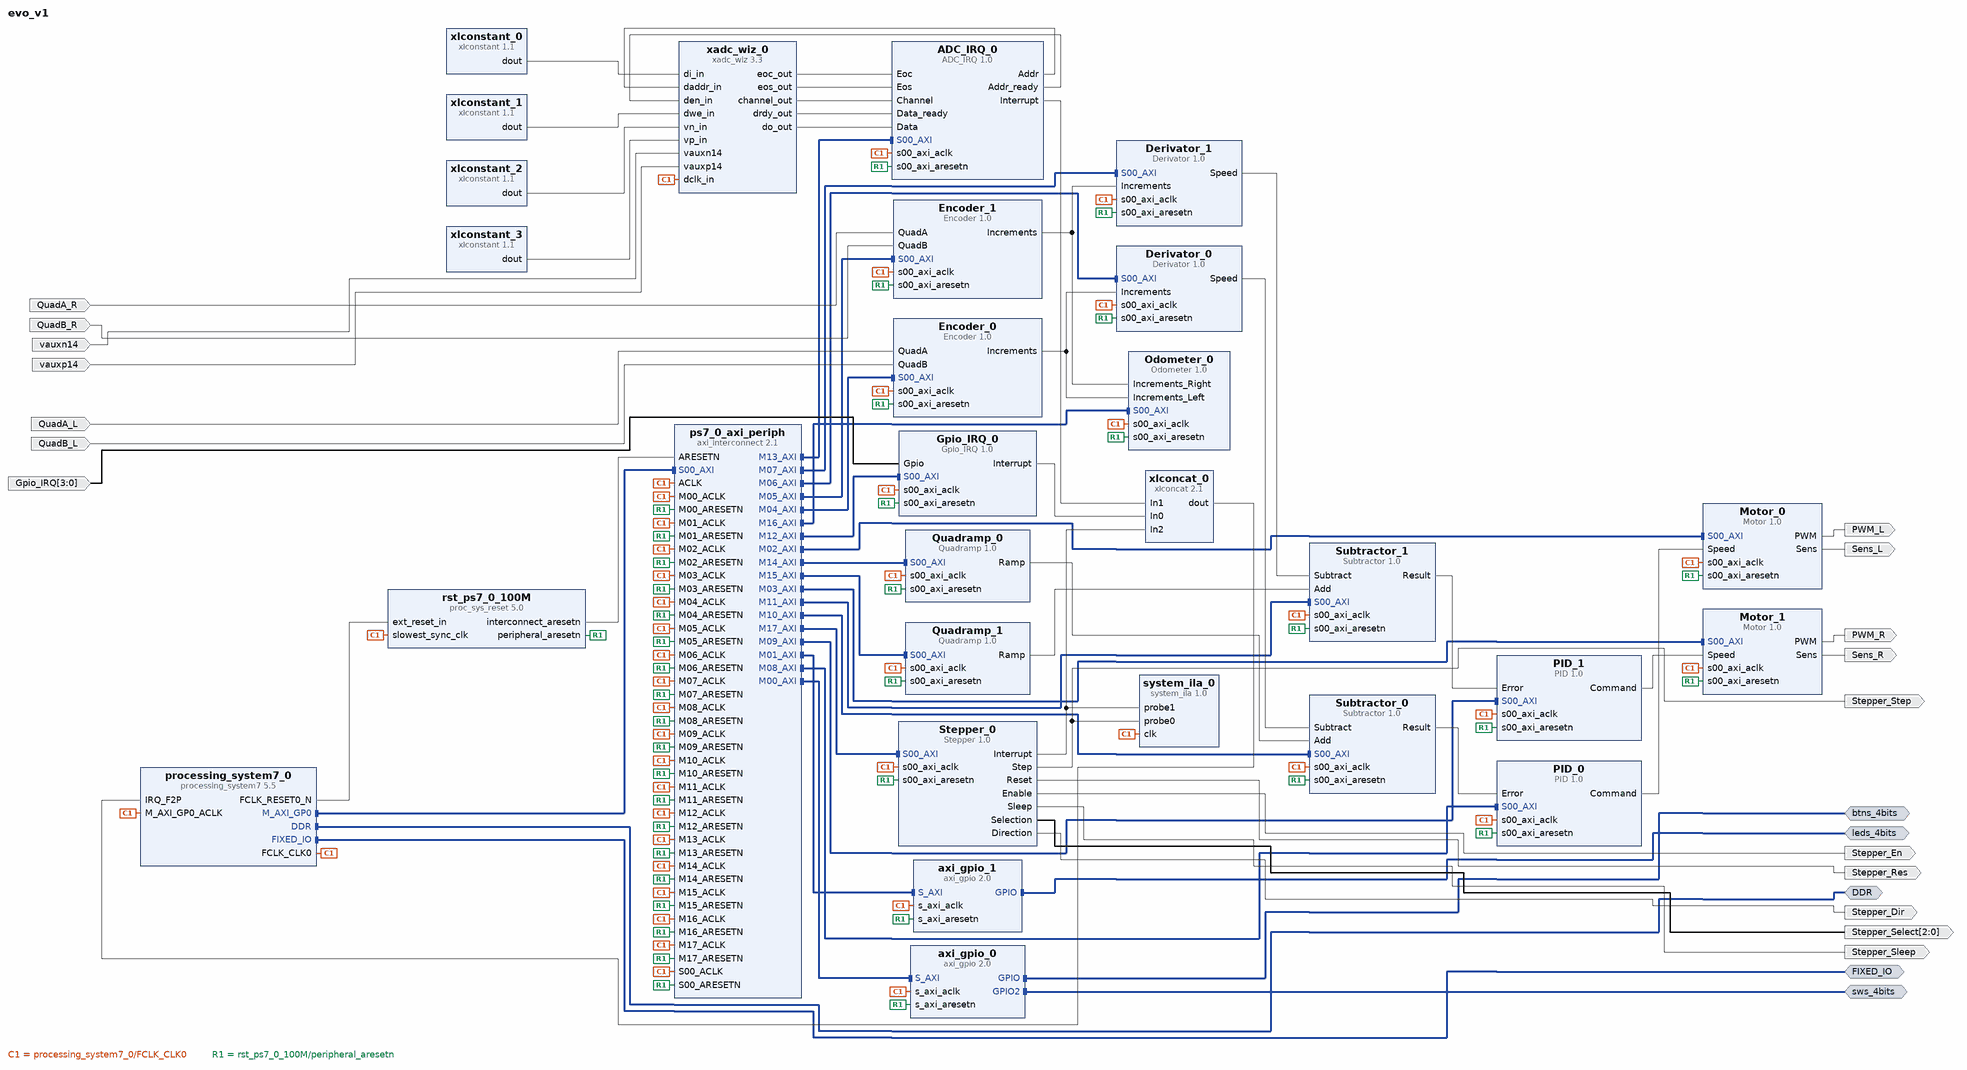
[diagram p0: block diagram of the top level]
# Vivado block design evo_v1, xc7z010clg400-1, Vivado 2017.2
create_bd_design evo_v1

create_bd_intf_port -mode Master -vlnv xilinx.com:interface:ddrx_rtl:1.0 DDR
create_bd_intf_port -mode Master -vlnv xilinx.com:display_processing_system7:fixedio_rtl:1.0 FIXED_IO
create_bd_intf_port -mode Master -vlnv xilinx.com:interface:gpio_rtl:1.0 leds_4bits
create_bd_intf_port -mode Master -vlnv xilinx.com:interface:gpio_rtl:1.0 btns_4bits
create_bd_intf_port -mode Master -vlnv xilinx.com:interface:gpio_rtl:1.0 sws_4bits
create_bd_port -dir I QuadA_L
create_bd_port -dir I QuadB_L
create_bd_port -dir I QuadA_R
create_bd_port -dir I QuadB_R
create_bd_port -dir O Sens_L
create_bd_port -dir O PWM_L
create_bd_port -dir O Sens_R
create_bd_port -dir O PWM_R
create_bd_port -dir I vauxn14
create_bd_port -dir I vauxp14
create_bd_port -dir I -from 3 -to 0 Gpio_IRQ
create_bd_port -dir O -type rst Stepper_Res
create_bd_port -dir O Stepper_En
create_bd_port -dir O Stepper_Sleep
create_bd_port -dir O -from 2 -to 0 Stepper_Select
create_bd_port -dir O Stepper_Step
create_bd_port -dir O Stepper_Dir

create_bd_cell -type ip -vlnv xilinx.com:ip:processing_system7:5.5 processing_system7_0
set_property -dict [list \
  CONFIG.PCW_UIPARAM_DDR_FREQ_MHZ 525 \
  CONFIG.PCW_CRYSTAL_PERIPHERAL_FREQMHZ 50.000000 \
  CONFIG.PCW_APU_PERIPHERAL_FREQMHZ 650 \
  CONFIG.PCW_SDIO_PERIPHERAL_FREQMHZ 50 \
  CONFIG.PCW_FPGA0_PERIPHERAL_FREQMHZ 100 \
  CONFIG.PCW_USE_FABRIC_INTERRUPT 1 \
  CONFIG.PCW_IRQ_F2P_INTR 1 \
  CONFIG.PCW_PRESET_BANK1_VOLTAGE {LVCMOS 1.8V} \
  CONFIG.PCW_UIPARAM_DDR_PARTNO {MT41K128M16 JT-125} \
  CONFIG.PCW_QSPI_PERIPHERAL_ENABLE 1 \
  CONFIG.PCW_QSPI_GRP_SINGLE_SS_ENABLE 1 \
  CONFIG.PCW_QSPI_GRP_FBCLK_ENABLE 1 \
  CONFIG.PCW_ENET0_PERIPHERAL_ENABLE 1 \
  CONFIG.PCW_ENET0_ENET0_IO {MIO 16 .. 27} \
  CONFIG.PCW_ENET0_GRP_MDIO_ENABLE 1 \
  CONFIG.PCW_ENET0_RESET_ENABLE 0 \
  CONFIG.PCW_SD0_PERIPHERAL_ENABLE 1 \
  CONFIG.PCW_SD0_GRP_CD_ENABLE 1 \
  CONFIG.PCW_SD0_GRP_CD_IO {MIO 47} \
  CONFIG.PCW_SD0_GRP_WP_ENABLE 1 \
  CONFIG.PCW_UART1_PERIPHERAL_ENABLE 1 \
  CONFIG.PCW_TTC0_PERIPHERAL_ENABLE 1 \
  CONFIG.PCW_USB0_PERIPHERAL_ENABLE 1 \
  CONFIG.PCW_USB0_RESET_ENABLE 1 \
  CONFIG.PCW_USB0_RESET_IO {MIO 46} \
  CONFIG.PCW_GPIO_MIO_GPIO_ENABLE 1 \
] [get_bd_cells processing_system7_0]
# 105 more settings of processing_system7_0 are not shown: defaults, MIO pin electricals, DDR timing, and values the tool derives
create_bd_cell -type ip -vlnv xilinx.com:ip:axi_gpio:2.0 axi_gpio_0
set_property -dict [list \
  CONFIG.C_INTERRUPT_PRESENT 0 \
  CONFIG.USE_BOARD_FLOW true \
  CONFIG.GPIO_BOARD_INTERFACE btns_4bits \
  CONFIG.GPIO2_BOARD_INTERFACE sws_4bits \
] [get_bd_cells axi_gpio_0]
create_bd_cell -type ip -vlnv xilinx.com:ip:axi_gpio:2.0 axi_gpio_1
set_property -dict {CONFIG.USE_BOARD_FLOW true CONFIG.GPIO_BOARD_INTERFACE leds_4bits} [get_bd_cells axi_gpio_1]
create_bd_cell -type ip -vlnv xilinx.com:ip:axi_interconnect:2.1 ps7_0_axi_periph
set_property -dict {CONFIG.NUM_MI 18} [get_bd_cells ps7_0_axi_periph]
create_bd_cell -type ip -vlnv xilinx.com:ip:proc_sys_reset:5.0 rst_ps7_0_100M
create_bd_cell -type ip -vlnv xilinx.com:user:Encoder:1.0 Encoder_0
create_bd_cell -type ip -vlnv xilinx.com:user:Encoder:1.0 Encoder_1
create_bd_cell -type ip -vlnv xilinx.com:user:Subtractor:1.0 Subtractor_0
create_bd_cell -type ip -vlnv xilinx.com:user:Subtractor:1.0 Subtractor_1
create_bd_cell -type ip -vlnv xilinx.com:user:PID:1.0 PID_0
set_property -dict {CONFIG.MIN 1 CONFIG.MAX 1} [get_bd_cells PID_0]
create_bd_cell -type ip -vlnv xilinx.com:user:PID:1.0 PID_1
set_property -dict {CONFIG.MIN 1 CONFIG.MAX 1} [get_bd_cells PID_1]
create_bd_cell -type ip -vlnv xilinx.com:user:Motor:1.0 Motor_0
create_bd_cell -type ip -vlnv xilinx.com:user:Motor:1.0 Motor_1
create_bd_cell -type ip -vlnv xilinx.com:ip:xadc_wiz:3.3 xadc_wiz_0
set_property -dict [list \
  CONFIG.INTERFACE_SELECTION ENABLE_DRP \
  CONFIG.XADC_STARUP_SELECTION channel_sequencer \
  CONFIG.SEQUENCER_MODE Continuous \
  CONFIG.ENABLE_RESET false \
  CONFIG.OT_ALARM false \
  CONFIG.USER_TEMP_ALARM false \
  CONFIG.VCCINT_ALARM false \
  CONFIG.VCCAUX_ALARM false \
  CONFIG.ENABLE_VCCPINT_ALARM false \
  CONFIG.ENABLE_VCCPAUX_ALARM false \
  CONFIG.ENABLE_VCCDDRO_ALARM false \
  CONFIG.SINGLE_CHANNEL_SELECTION TEMPERATURE \
  CONFIG.CHANNEL_AVERAGING None \
  CONFIG.ADC_OFFSET_CALIBRATION false \
  CONFIG.EXTERNAL_MUX_CHANNEL VP_VN \
  CONFIG.CHANNEL_ENABLE_CALIBRATION false \
  CONFIG.CHANNEL_ENABLE_TEMPERATURE false \
  CONFIG.CHANNEL_ENABLE_VCCINT false \
  CONFIG.CHANNEL_ENABLE_VCCAUX false \
  CONFIG.CHANNEL_ENABLE_VP_VN true \
  CONFIG.CHANNEL_ENABLE_VBRAM false \
  CONFIG.CHANNEL_ENABLE_VCCPINT false \
  CONFIG.CHANNEL_ENABLE_VCCPAUX false \
  CONFIG.CHANNEL_ENABLE_VCCDDRO false \
  CONFIG.CHANNEL_ENABLE_VAUXP4_VAUXN4 false \
  CONFIG.CHANNEL_ENABLE_VAUXP14_VAUXN14 true \
  CONFIG.AVERAGE_ENABLE_VAUXP14_VAUXN14 false \
] [get_bd_cells xadc_wiz_0]
create_bd_cell -type ip -vlnv xilinx.com:ip:xlconstant:1.1 xlconstant_0
set_property -dict {CONFIG.CONST_WIDTH 16 CONFIG.CONST_VAL 0} [get_bd_cells xlconstant_0]
create_bd_cell -type ip -vlnv xilinx.com:ip:xlconstant:1.1 xlconstant_1
set_property -dict {CONFIG.CONST_VAL 0} [get_bd_cells xlconstant_1]
create_bd_cell -type ip -vlnv xilinx.com:ip:xlconcat:2.1 xlconcat_0
set_property -dict {CONFIG.NUM_PORTS 3} [get_bd_cells xlconcat_0]
create_bd_cell -type ip -vlnv xilinx.com:ip:xlconstant:1.1 xlconstant_2
set_property -dict {CONFIG.CONST_WIDTH 1 CONFIG.CONST_VAL 0} [get_bd_cells xlconstant_2]
create_bd_cell -type ip -vlnv xilinx.com:ip:xlconstant:1.1 xlconstant_3
set_property -dict {CONFIG.CONST_WIDTH 1 CONFIG.CONST_VAL 0} [get_bd_cells xlconstant_3]
create_bd_cell -type ip -vlnv xilinx.com:user:ADC_IRQ:1.0 ADC_IRQ_0
create_bd_cell -type ip -vlnv xilinx.com:user:Gpio_IRQ:1.0 Gpio_IRQ_0
set_property -dict {CONFIG.GPIO_DATA_WIDTH 4} [get_bd_cells Gpio_IRQ_0]
create_bd_cell -type ip -vlnv xilinx.com:user:Odometer:1.0 Odometer_0
create_bd_cell -type ip -vlnv xilinx.com:user:Derivator:1.0 Derivator_0
create_bd_cell -type ip -vlnv xilinx.com:user:Derivator:1.0 Derivator_1
create_bd_cell -type ip -vlnv xilinx.com:user:Quadramp:1.0 Quadramp_0
create_bd_cell -type ip -vlnv xilinx.com:user:Quadramp:1.0 Quadramp_1
create_bd_cell -type ip -vlnv xilinx.com:ip:system_ila:1.0 system_ila_0
set_property -dict [list \
  CONFIG.C_SLOT_0_APC_EN 0 \
  CONFIG.C_SLOT_0_AXI_AW_SEL_DATA 1 \
  CONFIG.C_SLOT_0_AXI_W_SEL_DATA 1 \
  CONFIG.C_SLOT_0_AXI_B_SEL_DATA 1 \
  CONFIG.C_SLOT_0_AXI_AR_SEL_DATA 1 \
  CONFIG.C_SLOT_0_AXI_R_SEL_DATA 1 \
  CONFIG.C_SLOT_0_AXI_AW_SEL_TRIG 1 \
  CONFIG.C_SLOT_0_AXI_W_SEL_TRIG 1 \
  CONFIG.C_SLOT_0_AXI_B_SEL_TRIG 1 \
  CONFIG.C_SLOT_0_AXI_AR_SEL_TRIG 1 \
  CONFIG.C_SLOT_0_AXI_R_SEL_TRIG 1 \
  CONFIG.C_PROBE8_TYPE 0 \
  CONFIG.C_PROBE7_TYPE 0 \
  CONFIG.C_PROBE6_TYPE 0 \
  CONFIG.C_PROBE5_TYPE 0 \
  CONFIG.C_PROBE4_TYPE 0 \
  CONFIG.C_PROBE3_TYPE 0 \
  CONFIG.C_PROBE2_TYPE 0 \
  CONFIG.C_PROBE1_TYPE 0 \
  CONFIG.C_PROBE0_TYPE 0 \
  CONFIG.C_DATA_DEPTH 4096 \
  CONFIG.C_NUM_OF_PROBES 2 \
  CONFIG.C_NUM_MONITOR_SLOTS 1 \
  CONFIG.C_SLOT_0_INTF_TYPE xilinx.com:interface:aximm_rtl:1.0 \
  CONFIG.C_MON_TYPE NATIVE \
] [get_bd_cells system_ila_0]
create_bd_cell -type ip -vlnv xilinx.com:user:Stepper:1.0 Stepper_0

# ---- connections ----

connect_bd_intf_net [get_bd_intf_pins processing_system7_0/M_AXI_GP0] [get_bd_intf_pins ps7_0_axi_periph/S00_AXI]
connect_bd_intf_net [get_bd_intf_pins ps7_0_axi_periph/M00_AXI] [get_bd_intf_pins axi_gpio_0/S_AXI]
connect_bd_intf_net [get_bd_intf_pins ps7_0_axi_periph/M01_AXI] [get_bd_intf_pins axi_gpio_1/S_AXI]
connect_bd_intf_net [get_bd_intf_pins ps7_0_axi_periph/M02_AXI] [get_bd_intf_pins Motor_0/S00_AXI]
connect_bd_intf_net [get_bd_intf_pins ps7_0_axi_periph/M03_AXI] [get_bd_intf_pins Motor_1/S00_AXI]
connect_bd_intf_net [get_bd_intf_pins ps7_0_axi_periph/M04_AXI] [get_bd_intf_pins Encoder_0/S00_AXI]
connect_bd_intf_net [get_bd_intf_pins ps7_0_axi_periph/M05_AXI] [get_bd_intf_pins Encoder_1/S00_AXI]
connect_bd_intf_net [get_bd_intf_pins ps7_0_axi_periph/M06_AXI] [get_bd_intf_pins Derivator_0/S00_AXI]
connect_bd_intf_net [get_bd_intf_pins ps7_0_axi_periph/M07_AXI] [get_bd_intf_pins Derivator_1/S00_AXI]
connect_bd_intf_net [get_bd_intf_pins ps7_0_axi_periph/M08_AXI] [get_bd_intf_pins PID_0/S00_AXI]
connect_bd_intf_net [get_bd_intf_pins ps7_0_axi_periph/M09_AXI] [get_bd_intf_pins PID_1/S00_AXI]
connect_bd_intf_net [get_bd_intf_pins ps7_0_axi_periph/M10_AXI] [get_bd_intf_pins Subtractor_0/S00_AXI]
connect_bd_intf_net [get_bd_intf_pins ps7_0_axi_periph/M11_AXI] [get_bd_intf_pins Subtractor_1/S00_AXI]
connect_bd_intf_net [get_bd_intf_pins ps7_0_axi_periph/M12_AXI] [get_bd_intf_pins Gpio_IRQ_0/S00_AXI]
connect_bd_intf_net [get_bd_intf_pins ADC_IRQ_0/S00_AXI] [get_bd_intf_pins ps7_0_axi_periph/M13_AXI]
connect_bd_intf_net [get_bd_intf_pins ps7_0_axi_periph/M14_AXI] [get_bd_intf_pins Quadramp_0/S00_AXI]
connect_bd_intf_net [get_bd_intf_pins ps7_0_axi_periph/M15_AXI] [get_bd_intf_pins Quadramp_1/S00_AXI]
connect_bd_intf_net [get_bd_intf_pins ps7_0_axi_periph/M16_AXI] [get_bd_intf_pins Odometer_0/S00_AXI]
connect_bd_intf_net [get_bd_intf_pins ps7_0_axi_periph/M17_AXI] [get_bd_intf_pins Stepper_0/S00_AXI]
connect_bd_intf_net [get_bd_intf_ports DDR] [get_bd_intf_pins processing_system7_0/DDR]
connect_bd_intf_net [get_bd_intf_ports FIXED_IO] [get_bd_intf_pins processing_system7_0/FIXED_IO]
connect_bd_intf_net [get_bd_intf_ports leds_4bits] [get_bd_intf_pins axi_gpio_1/GPIO]
connect_bd_intf_net [get_bd_intf_ports btns_4bits] [get_bd_intf_pins axi_gpio_0/GPIO]
connect_bd_intf_net [get_bd_intf_ports sws_4bits] [get_bd_intf_pins axi_gpio_0/GPIO2]
connect_bd_net [get_bd_pins processing_system7_0/FCLK_CLK0] \
  [get_bd_pins processing_system7_0/M_AXI_GP0_ACLK] [get_bd_pins rst_ps7_0_100M/slowest_sync_clk] \
  [get_bd_pins axi_gpio_0/s_axi_aclk] [get_bd_pins axi_gpio_1/s_axi_aclk] [get_bd_pins Encoder_0/s00_axi_aclk] \
  [get_bd_pins Encoder_1/s00_axi_aclk] [get_bd_pins Subtractor_0/s00_axi_aclk] [get_bd_pins Subtractor_1/s00_axi_aclk] \
  [get_bd_pins PID_0/s00_axi_aclk] [get_bd_pins PID_1/s00_axi_aclk] [get_bd_pins Motor_0/s00_axi_aclk] \
  [get_bd_pins Motor_1/s00_axi_aclk] [get_bd_pins xadc_wiz_0/dclk_in] [get_bd_pins ADC_IRQ_0/s00_axi_aclk] \
  [get_bd_pins Gpio_IRQ_0/s00_axi_aclk] [get_bd_pins Odometer_0/s00_axi_aclk] [get_bd_pins Derivator_0/s00_axi_aclk] \
  [get_bd_pins Derivator_1/s00_axi_aclk] [get_bd_pins Quadramp_0/s00_axi_aclk] [get_bd_pins Quadramp_1/s00_axi_aclk] \
  [get_bd_pins system_ila_0/clk] [get_bd_pins ps7_0_axi_periph/S00_ACLK] [get_bd_pins ps7_0_axi_periph/M00_ACLK] \
  [get_bd_pins ps7_0_axi_periph/ACLK] [get_bd_pins ps7_0_axi_periph/M01_ACLK] [get_bd_pins ps7_0_axi_periph/M02_ACLK] \
  [get_bd_pins ps7_0_axi_periph/M03_ACLK] [get_bd_pins ps7_0_axi_periph/M04_ACLK] [get_bd_pins ps7_0_axi_periph/M05_ACLK] \
  [get_bd_pins ps7_0_axi_periph/M06_ACLK] [get_bd_pins ps7_0_axi_periph/M07_ACLK] [get_bd_pins ps7_0_axi_periph/M08_ACLK] \
  [get_bd_pins ps7_0_axi_periph/M09_ACLK] [get_bd_pins ps7_0_axi_periph/M10_ACLK] [get_bd_pins ps7_0_axi_periph/M11_ACLK] \
  [get_bd_pins ps7_0_axi_periph/M12_ACLK] [get_bd_pins ps7_0_axi_periph/M13_ACLK] [get_bd_pins ps7_0_axi_periph/M14_ACLK] \
  [get_bd_pins ps7_0_axi_periph/M15_ACLK] [get_bd_pins ps7_0_axi_periph/M16_ACLK] [get_bd_pins ps7_0_axi_periph/M17_ACLK] \
  [get_bd_pins Stepper_0/s00_axi_aclk]
connect_bd_net [get_bd_pins rst_ps7_0_100M/peripheral_aresetn] \
  [get_bd_pins axi_gpio_0/s_axi_aresetn] [get_bd_pins axi_gpio_1/s_axi_aresetn] [get_bd_pins Encoder_0/s00_axi_aresetn] \
  [get_bd_pins Encoder_1/s00_axi_aresetn] [get_bd_pins Subtractor_0/s00_axi_aresetn] \
  [get_bd_pins Subtractor_1/s00_axi_aresetn] [get_bd_pins PID_0/s00_axi_aresetn] [get_bd_pins PID_1/s00_axi_aresetn] \
  [get_bd_pins Motor_0/s00_axi_aresetn] [get_bd_pins Motor_1/s00_axi_aresetn] [get_bd_pins ADC_IRQ_0/s00_axi_aresetn] \
  [get_bd_pins Gpio_IRQ_0/s00_axi_aresetn] [get_bd_pins Odometer_0/s00_axi_aresetn] [get_bd_pins Derivator_0/s00_axi_aresetn] \
  [get_bd_pins Derivator_1/s00_axi_aresetn] [get_bd_pins Quadramp_0/s00_axi_aresetn] [get_bd_pins Quadramp_1/s00_axi_aresetn] \
  [get_bd_pins ps7_0_axi_periph/S00_ARESETN] [get_bd_pins ps7_0_axi_periph/M00_ARESETN] \
  [get_bd_pins ps7_0_axi_periph/M01_ARESETN] [get_bd_pins ps7_0_axi_periph/M02_ARESETN] \
  [get_bd_pins ps7_0_axi_periph/M03_ARESETN] [get_bd_pins ps7_0_axi_periph/M04_ARESETN] \
  [get_bd_pins ps7_0_axi_periph/M05_ARESETN] [get_bd_pins ps7_0_axi_periph/M06_ARESETN] \
  [get_bd_pins ps7_0_axi_periph/M07_ARESETN] [get_bd_pins ps7_0_axi_periph/M08_ARESETN] \
  [get_bd_pins ps7_0_axi_periph/M09_ARESETN] [get_bd_pins ps7_0_axi_periph/M10_ARESETN] \
  [get_bd_pins ps7_0_axi_periph/M11_ARESETN] [get_bd_pins ps7_0_axi_periph/M12_ARESETN] \
  [get_bd_pins ps7_0_axi_periph/M13_ARESETN] [get_bd_pins ps7_0_axi_periph/M14_ARESETN] \
  [get_bd_pins ps7_0_axi_periph/M15_ARESETN] [get_bd_pins ps7_0_axi_periph/M16_ARESETN] \
  [get_bd_pins ps7_0_axi_periph/M17_ARESETN] [get_bd_pins Stepper_0/s00_axi_aresetn]
connect_bd_net [get_bd_pins rst_ps7_0_100M/interconnect_aresetn] [get_bd_pins ps7_0_axi_periph/ARESETN]
connect_bd_net [get_bd_pins PID_1/Command] [get_bd_pins Motor_1/Speed]
connect_bd_net [get_bd_pins Subtractor_1/Result] [get_bd_pins PID_1/Error]
connect_bd_net [get_bd_pins Derivator_1/Speed] [get_bd_pins Subtractor_1/Subtract]
connect_bd_net [get_bd_pins Encoder_1/Increments] [get_bd_pins Odometer_0/Increments_Right] [get_bd_pins Derivator_1/Increments]
connect_bd_net [get_bd_pins Encoder_0/Increments] [get_bd_pins Odometer_0/Increments_Left] [get_bd_pins Derivator_0/Increments]
connect_bd_net [get_bd_pins Derivator_0/Speed] [get_bd_pins Subtractor_0/Subtract]
connect_bd_net [get_bd_pins Subtractor_0/Result] [get_bd_pins PID_0/Error]
connect_bd_net [get_bd_pins PID_0/Command] [get_bd_pins Motor_0/Speed]
connect_bd_net [get_bd_pins processing_system7_0/FCLK_RESET0_N] [get_bd_pins rst_ps7_0_100M/ext_reset_in]
connect_bd_net [get_bd_ports QuadA_L] [get_bd_pins Encoder_0/QuadA]
connect_bd_net [get_bd_ports QuadB_L] [get_bd_pins Encoder_0/QuadB]
connect_bd_net [get_bd_ports QuadA_R] [get_bd_pins Encoder_1/QuadA]
connect_bd_net [get_bd_ports QuadB_R] [get_bd_pins Encoder_1/QuadB]
connect_bd_net [get_bd_pins Motor_0/Sens] [get_bd_ports Sens_L]
connect_bd_net [get_bd_pins Motor_0/PWM] [get_bd_ports PWM_L]
connect_bd_net [get_bd_pins Motor_1/Sens] [get_bd_ports Sens_R]
connect_bd_net [get_bd_pins Motor_1/PWM] [get_bd_ports PWM_R]
connect_bd_net [get_bd_pins xlconstant_0/dout] [get_bd_pins xadc_wiz_0/di_in]
connect_bd_net [get_bd_pins xlconstant_1/dout] [get_bd_pins xadc_wiz_0/dwe_in]
connect_bd_net -net vauxn14_1 [get_bd_ports vauxn14] [get_bd_pins xadc_wiz_0/vauxn14]
connect_bd_net -net vauxp14_1 [get_bd_ports vauxp14] [get_bd_pins xadc_wiz_0/vauxp14]
connect_bd_net [get_bd_pins ADC_IRQ_0/Addr] [get_bd_pins xadc_wiz_0/daddr_in]
connect_bd_net [get_bd_pins ADC_IRQ_0/Addr_ready] [get_bd_pins xadc_wiz_0/den_in]
connect_bd_net [get_bd_pins xadc_wiz_0/eoc_out] [get_bd_pins ADC_IRQ_0/Eoc]
connect_bd_net [get_bd_pins xadc_wiz_0/eos_out] [get_bd_pins ADC_IRQ_0/Eos]
connect_bd_net [get_bd_pins xadc_wiz_0/channel_out] [get_bd_pins ADC_IRQ_0/Channel]
connect_bd_net [get_bd_pins xadc_wiz_0/drdy_out] [get_bd_pins ADC_IRQ_0/Data_ready]
connect_bd_net [get_bd_pins xadc_wiz_0/do_out] [get_bd_pins ADC_IRQ_0/Data]
connect_bd_net [get_bd_pins ADC_IRQ_0/Interrupt] [get_bd_pins xlconcat_0/In1]
connect_bd_net [get_bd_pins Gpio_IRQ_0/Interrupt] [get_bd_pins xlconcat_0/In0]
connect_bd_net [get_bd_pins xlconcat_0/dout] [get_bd_pins processing_system7_0/IRQ_F2P]
connect_bd_net [get_bd_pins Quadramp_0/Ramp] [get_bd_pins Subtractor_0/Add]
connect_bd_net [get_bd_pins Quadramp_1/Ramp] [get_bd_pins Subtractor_1/Add]
connect_bd_net [get_bd_pins xlconstant_2/dout] [get_bd_pins xadc_wiz_0/vn_in]
connect_bd_net [get_bd_pins xlconstant_3/dout] [get_bd_pins xadc_wiz_0/vp_in]
connect_bd_net [get_bd_ports Gpio_IRQ] [get_bd_pins Gpio_IRQ_0/Gpio]
connect_bd_net [get_bd_pins Stepper_0/Reset] [get_bd_ports Stepper_Res]
connect_bd_net [get_bd_pins Stepper_0/Enable] [get_bd_ports Stepper_En]
connect_bd_net [get_bd_pins Stepper_0/Sleep] [get_bd_ports Stepper_Sleep]
connect_bd_net [get_bd_pins Stepper_0/Selection] [get_bd_ports Stepper_Select]
connect_bd_net [get_bd_pins Stepper_0/Step] [get_bd_ports Stepper_Step] [get_bd_pins system_ila_0/probe0]
connect_bd_net [get_bd_pins Stepper_0/Direction] [get_bd_ports Stepper_Dir]
connect_bd_net [get_bd_pins Stepper_0/Interrupt] [get_bd_pins xlconcat_0/In2] [get_bd_pins system_ila_0/probe1]

# ---- address map ----
assign_bd_address -offset 0x41200000 -range 64K -target_address_space [get_bd_addr_spaces processing_system7_0/Data] [get_bd_addr_segs axi_gpio_0/S_AXI/Reg]
assign_bd_address -offset 0x41210000 -range 64K -target_address_space [get_bd_addr_spaces processing_system7_0/Data] [get_bd_addr_segs axi_gpio_1/S_AXI/Reg]
assign_bd_address -offset 0x43C00000 -range 64K -target_address_space [get_bd_addr_spaces processing_system7_0/Data] [get_bd_addr_segs Motor_0/S00_AXI/S00_AXI_reg]
assign_bd_address -offset 0x43C10000 -range 64K -target_address_space [get_bd_addr_spaces processing_system7_0/Data] [get_bd_addr_segs Motor_1/S00_AXI/S00_AXI_reg]
assign_bd_address -offset 0x43C20000 -range 64K -target_address_space [get_bd_addr_spaces processing_system7_0/Data] [get_bd_addr_segs Encoder_0/S00_AXI/S00_AXI_reg]
assign_bd_address -offset 0x43C30000 -range 64K -target_address_space [get_bd_addr_spaces processing_system7_0/Data] [get_bd_addr_segs Encoder_1/S00_AXI/S00_AXI_reg]
assign_bd_address -offset 0x43C40000 -range 64K -target_address_space [get_bd_addr_spaces processing_system7_0/Data] [get_bd_addr_segs Derivator_0/S00_AXI/S00_AXI_reg]
assign_bd_address -offset 0x43C50000 -range 64K -target_address_space [get_bd_addr_spaces processing_system7_0/Data] [get_bd_addr_segs Derivator_1/S00_AXI/S00_AXI_reg]
assign_bd_address -offset 0x43C60000 -range 64K -target_address_space [get_bd_addr_spaces processing_system7_0/Data] [get_bd_addr_segs PID_0/S00_AXI/S00_AXI_reg]
assign_bd_address -offset 0x43C70000 -range 64K -target_address_space [get_bd_addr_spaces processing_system7_0/Data] [get_bd_addr_segs PID_1/S00_AXI/S00_AXI_reg]
assign_bd_address -offset 0x43C80000 -range 64K -target_address_space [get_bd_addr_spaces processing_system7_0/Data] [get_bd_addr_segs Subtractor_0/S00_AXI/S00_AXI_reg]
assign_bd_address -offset 0x43C90000 -range 64K -target_address_space [get_bd_addr_spaces processing_system7_0/Data] [get_bd_addr_segs Subtractor_1/S00_AXI/S00_AXI_reg]
assign_bd_address -offset 0x43CA0000 -range 64K -target_address_space [get_bd_addr_spaces processing_system7_0/Data] [get_bd_addr_segs Gpio_IRQ_0/S00_AXI/S00_AXI_reg]
assign_bd_address -offset 0x43CB0000 -range 64K -target_address_space [get_bd_addr_spaces processing_system7_0/Data] [get_bd_addr_segs Quadramp_0/S00_AXI/S00_AXI_reg]
assign_bd_address -offset 0x43CC0000 -range 64K -target_address_space [get_bd_addr_spaces processing_system7_0/Data] [get_bd_addr_segs ADC_IRQ_0/S00_AXI/S00_AXI_reg]
assign_bd_address -offset 0x43CD0000 -range 64K -target_address_space [get_bd_addr_spaces processing_system7_0/Data] [get_bd_addr_segs Quadramp_1/S00_AXI/S00_AXI_reg]
assign_bd_address -offset 0x43CE0000 -range 64K -target_address_space [get_bd_addr_spaces processing_system7_0/Data] [get_bd_addr_segs Odometer_0/S00_AXI/S00_AXI_reg]
assign_bd_address -offset 0x43CF0000 -range 64K -target_address_space [get_bd_addr_spaces processing_system7_0/Data] [get_bd_addr_segs Stepper_0/S00_AXI/S00_AXI_reg]

validate_bd_design
save_bd_design
